# EAGLE board stream_i-o_2_3 (EAGLE 7.5.0), part 1 of 2
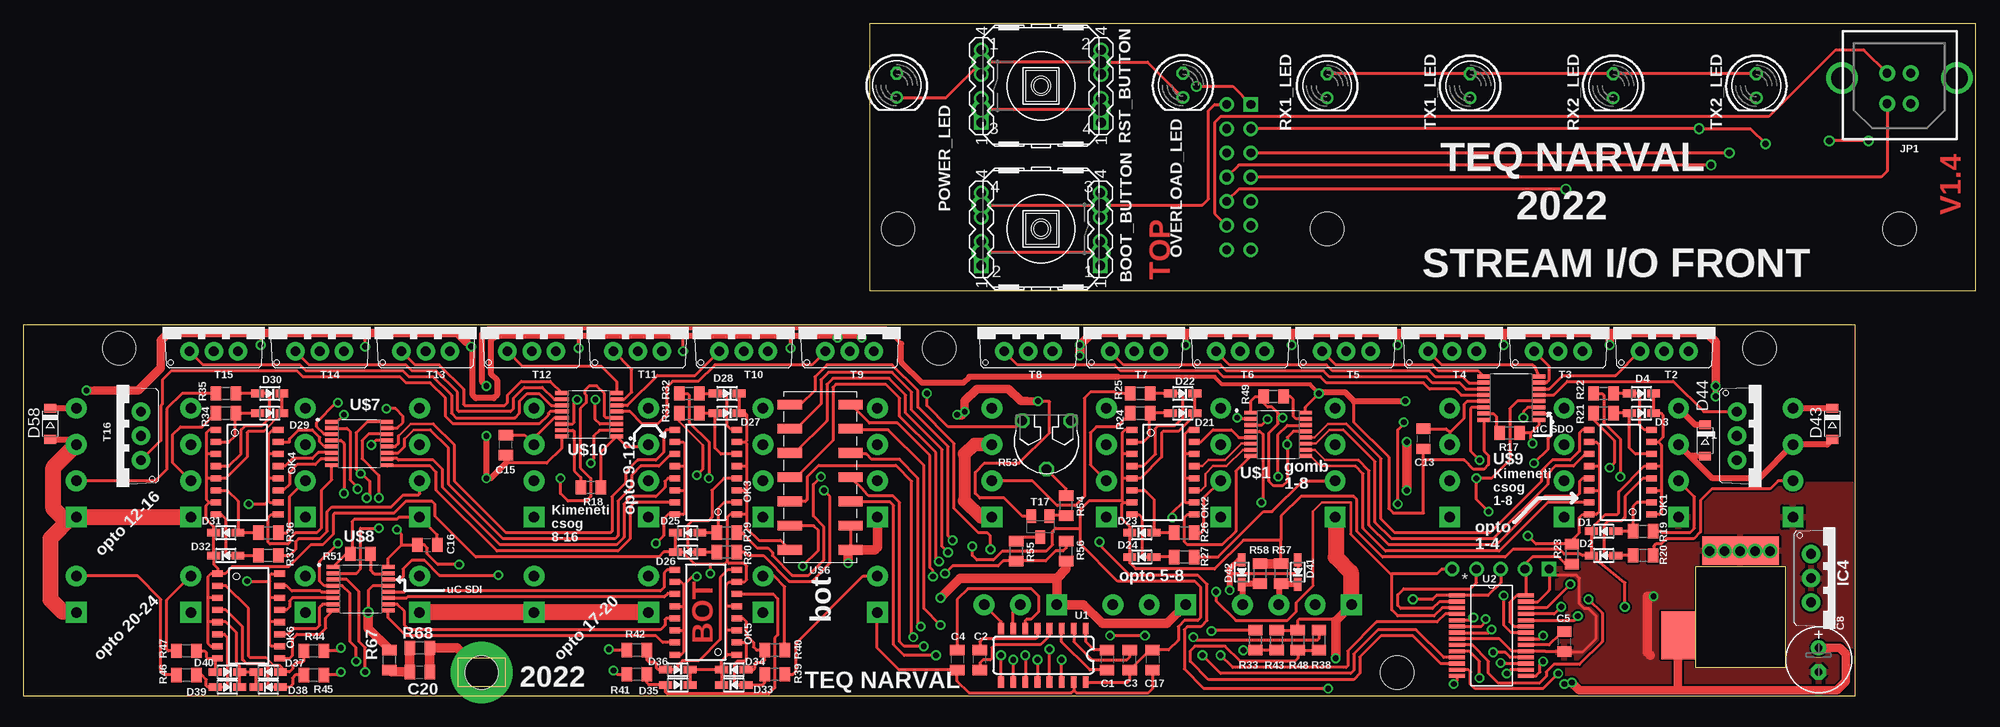
[diagram p3: board, top side]
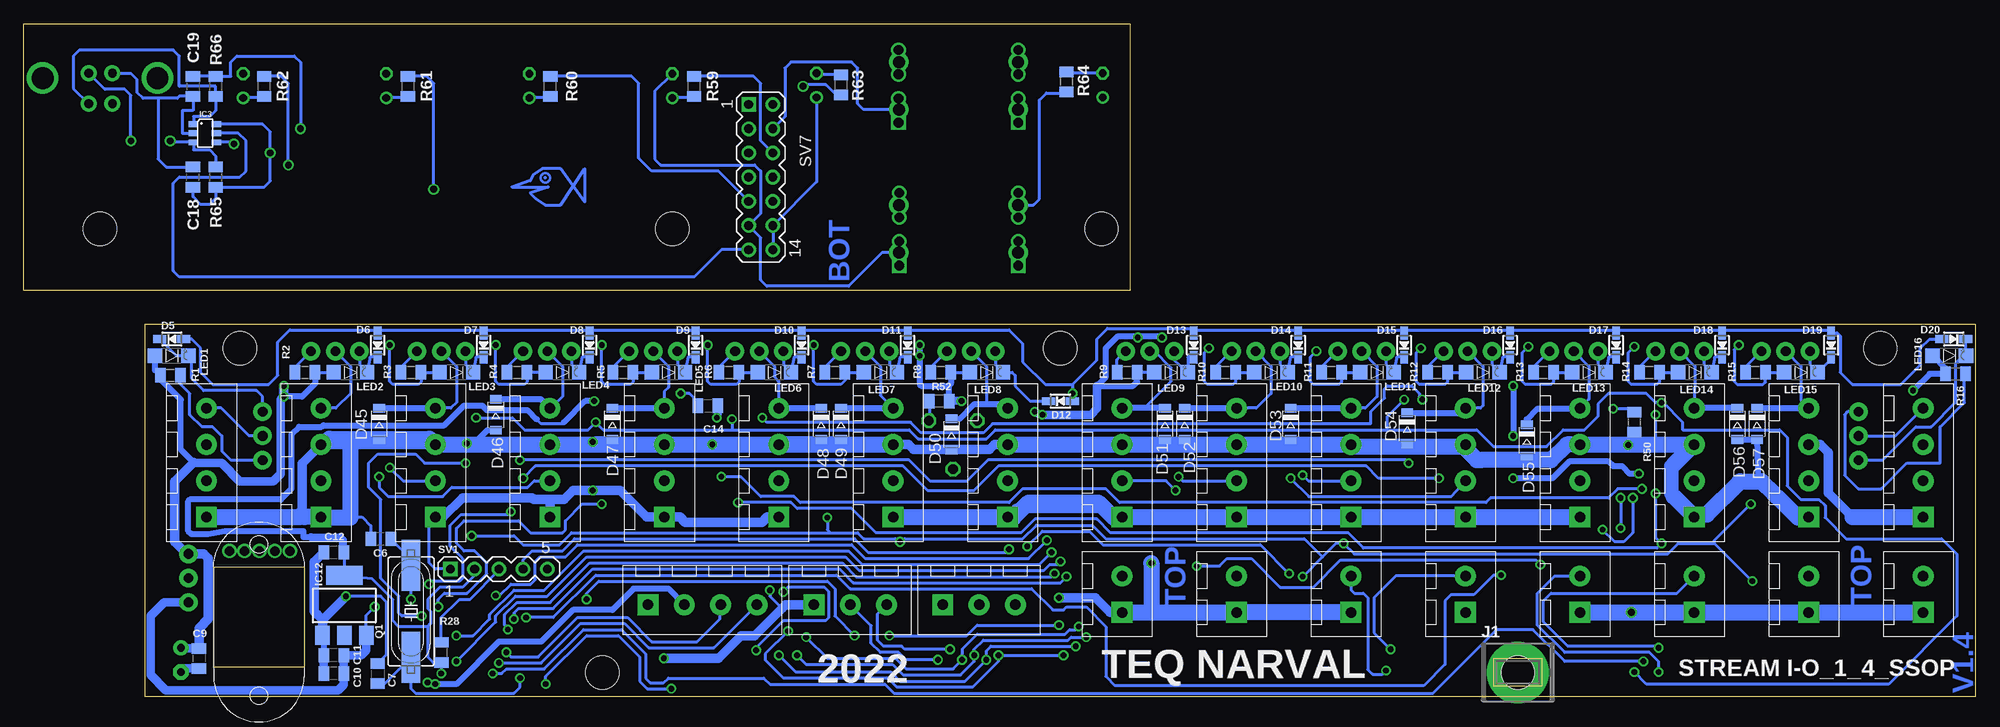
[diagram p4: board, bottom side, seen from below]

Size 204.65 x 70.53 mm. Coordinates in mm from the lower left corner, seen from the top.
Outline: 192,0 0,0 0,39 192,39 192,0
Outline: 88.65,42.53 204.65,42.53 204.65,70.53 88.65,70.53 88.65,42.53
Copper layers (1*16): Top 0.035mm / dielectric 1.5mm / Bottom 0.035mm
Design rules "10mil *": minimum track width 10mil, minimum drill 24mil, track to track 7mil, track to pad 7mil, pad to pad 7mil, via to via 7mil, smd to smd 7mil, copper to edge 5mil, drill to drill 5mil, minimum pad ring 10mil, minimum via ring 8mil, stop-mask expansion 4mil, vias tented up to drill 0mil, thermal gap 10mil
Net classes: 0 default: width 0.203 mm, clearance 0.203 mm
Holes 3.5 mm at 182,36.5 96,36.5 10,36.5 144,2.5 48,2.5 136.65,49.03 196.65,49.03 91.65,49.03

## Footprints (pad centres in the part's own frame; a part is rotated, then mirrored left to right if it is on the bottom)
RACON12 = drill 1.27 pad 2.032: 1 -6.248,2.489; 2 6.248,2.489; 3 -6.248,-2.489; 4 6.248,-2.489
C0805 = smd 1.1 x 1.5: 1 -1.05,0; 2 1.05,0
E2,5-7 = drill 0.813 pad 1.6: + -1.27,0 | drill 0.813 pad 1.6 octagon: - 1.27,0
SOD-323 = smd 1.35 x 0.8: A 1.27,0; C -1.27,0
SOD-123 = smd 0.91 x 1.22: A 1.635,0; C -1.635,0
DC_55/21 = smd 8 x 3 bottom: 1 0,6.985 | smd 3.5 x 5 bottom: 2 6.565,-1.905
TSOP-6 = smd 0.6 x 1: 1 -0.95,-1.2; 2 0,-1.2; 3 0.95,-1.2; 4 0.95,1.2; 5 0,1.2; 6 -0.95,1.2
TO220V = drill 1.016 pad 1.93: 1 -2.54,-2.54; 2 0,-2.54; 3 2.54,-2.54
SOT223 = smd 1.5 x 2: 1 -2.3,-3.15; 2 0,-3.15; 3 2.3,-3.15 | smd 3.8 x 2: 4 0,3.15
62221 = drill 3.5 pad 6.452: 1 0,0
USB-B-PTH-VERTICAL = drill 0.914 pad 1.676: D+ -1.206,-1.321; D- -1.206,1.88; GND 1.283,-1.321; VBUS 1.283,1.88 | drill 2.286: P$1 -6.032,-0.813; P$2 6.007,-0.813
CHIPLED_1206 = smd 1.5 x 1.5: A 0,-1.75; C 0,1.75
MINI-FLAT-16 = smd 1.118 x 0.635: 1 -3.265,4.445; 2 -3.265,3.175; 3 -3.265,1.905; 4 -3.265,0.635; 5 -3.265,-0.635; 6 -3.265,-1.905; 7 -3.265,-3.175; 8 -3.265,-4.445; 9 3.265,-4.445; 10 3.265,-3.175; 11 3.265,-1.905; 12 3.265,-0.635; 13 3.265,0.635; 14 3.265,1.905; 15 3.265,3.175; 16 3.265,4.445
LED5MM = drill 0.813 octagon: A -1.27,0 | drill 0.813: K 1.27,0
HC49UP = smd 5.334 x 1.93: 1 -4.826,0; 2 4.826,0
R0805 = smd 1.1 x 1.5: 1 -1.05,0; 2 1.05,0
PT-6 = drill 1.016 octagon: A -2.54,-5.08; E 2.54,-5.08; S 0,0
MA05-1 = drill 0.914 pad 1.524 square: 1 -5.08,0 | drill 0.914 pad 1.524: 2 -2.54,0; 3 0,0; 4 2.54,0; 5 5.08,0
MA04-1 = drill 1.016 square: 1 -3.81,0 | drill 1.016: 2 -1.27,0; 3 1.27,0; 4 3.81,0
MA07-2 = drill 0.914 pad 1.524 square: 1 -7.62,-1.27 | drill 0.914 pad 1.524: 2 -7.62,1.27; 3 -5.08,-1.27; 4 -5.08,1.27; 5 -2.54,-1.27; 6 -2.54,1.27; 7 0,-1.27; 8 0,1.27; 9 2.54,-1.27; 10 2.54,1.27; 11 5.08,-1.27; 12 5.08,1.27; 13 7.62,-1.27; 14 7.62,1.27
SOT23-BEC = smd 1 x 1.4: B -0.95,-1.1; C 0,1.1; E 0.95,-1.1
SO016 = smd 0.6 x 1.2: 1 -4.445,-2.8; 2 -3.175,-2.8; 3 -1.905,-2.8; 4 -0.635,-2.8; 5 0.635,-2.8; 6 1.905,-2.8; 7 3.175,-2.8; 8 4.445,-2.8; 9 4.445,2.8; 10 3.175,2.8; 11 1.905,2.8; 12 0.635,2.8; 13 -0.635,2.8; 14 -1.905,2.8; 15 -3.175,2.8; 16 -4.445,2.8
SSOP28_MC = smd 1.676 x 0.432: 1 -3.617,4.225; 2 -3.617,3.575; 3 -3.617,2.925; 4 -3.617,2.275; 5 -3.617,1.625; 6 -3.617,0.975; 7 -3.617,0.325; 8 -3.617,-0.325; 9 -3.617,-0.975; 10 -3.617,-1.625; 11 -3.617,-2.275; 12 -3.617,-2.925; 13 -3.617,-3.575; 14 -3.617,-4.225; 15 3.617,-4.225; 16 3.617,-3.575; 17 3.617,-2.925; 18 3.617,-2.275; 19 3.617,-1.625; 20 3.617,-0.975; 21 3.617,-0.325; 22 3.617,0.325; 23 3.617,0.975; 24 3.617,1.625; 25 3.617,2.275; 26 3.617,2.925; 27 3.617,3.575; 28 3.617,4.225
SSOP = smd 1.47 x 0.41: 1 -2.87,2.275; 2 -2.87,1.625; 3 -2.87,0.975; 4 -2.87,0.325; 5 -2.87,-0.325; 6 -2.87,-0.975; 7 -2.87,-1.625; 8 -2.87,-2.275; 9 2.87,-2.275; 10 2.87,-1.625; 11 2.87,-0.975; 12 2.87,-0.325; 13 2.87,0.325; 14 2.87,0.975; 15 2.87,1.625; 16 2.87,2.275
PIN_HEADER_2X7 = smd 1.016 x 2.54: 1A -7.62,3.175; 1B -7.62,-3.175; 2A -5.08,3.175; 2B -5.08,-3.175; 3A -2.54,3.175; 3B -2.54,-3.175; 4A 0,3.175; 4B 0,-3.175; 5A 2.54,3.175; 5B 2.54,-3.175; 6A 5.08,3.175; 6B 5.08,-3.175; 7A 7.62,3.175; 7B 7.62,-3.175
ZOLD_KICSI_2P = drill 1.1 pad 2.184 square: 1 -1.905,-0.5 | drill 1.1 pad 2.184: 2 1.905,-0.5
ZOLD_KICSI_3P = drill 1.1 pad 2.184 square: 1 -3.81,-0.5 | drill 1.1 pad 2.184: 2 0,-0.5; 3 3.81,-0.5
ZOLD_KICSI_4P = drill 1.1 pad 2.184 square: 1 -5.715,-0.5 | drill 1.1 pad 2.184: 2 -1.905,-0.5; 3 1.905,-0.5; 4 5.715,-0.5

## Placement (x,y rotation side)
BOOT_BUTTON  BUTTONRACON12  [RACON12]  106.65,49.03 180 top
C1  1u  [C0805]  113.58,3.81 270 top
C2  1u  [C0805]  100.24,3.81 90 top
C3  1u  [C0805]  115.96,3.81 90 top
C4  1u  [C0805]  97.86,3.81 270 top
C5  10u  [C0805]  161.52,5.71 270 top
C6  22p  [C0805]  167.24,16.51 0 bottom
C7  22p  [C0805]  167.55,2.38 270 bottom
C8  220u  [E2,5-7]  188.19,3.81 270 top
C9  100n  [C0805]  186.28,3.97 270 bottom
C10  10u  [C0805]  172.16,2.38 180 bottom
C11  10u  [C0805]  172.16,4.29 180 bottom
C12  10u  [C0805]  172.16,15.08 180 bottom
C13  100n  [C0805]  146.76,26.99 90 top
C14  100n  [C0805]  132.94,30.48 0 bottom
C15  100n  [C0805]  50.55,26.35 90 top
C16  100n  [C0805]  42.3,15.88 0 top
C17  100n  [C0805]  118.34,3.81 270 top
C18  47p  [C0805]  186.92,54.45 90 bottom
C19  47p  [C0805]  186.92,63.98 270 bottom
C20  100n  [C0805]  41.51,2.54 0 top
D1  1N4148  [SOD-323]  165.65,17.3 0 top
D2  1N4148  [SOD-323]  165.65,14.76 0 top
D3  1N4148  [SOD-323]  169.62,29.69 180 top
D4  1N4148  [SOD-323]  169.62,31.75 180 top
D5  1N4148  [SOD-323]  189.14,37.47 0 bottom
D6  1N4148  [SOD-323]  167.55,36.83 90 bottom
D7  1N4148  [SOD-323]  156.44,36.83 90 bottom
D8  1N4148  [SOD-323]  145.33,36.83 90 bottom
D9  1N4148  [SOD-323]  134.22,36.83 90 bottom
D10  1N4148  [SOD-323]  123.1,36.83 90 bottom
D11  1N4148  [SOD-323]  111.99,36.83 90 bottom
D12  1N4148  [SOD-323]  95.96,30.96 0 bottom
D13  1N4148  [SOD-323]  81.99,36.83 90 bottom
D14  1N4148  [SOD-323]  71.03,36.83 90 bottom
D15  1N4148  [SOD-323]  59.92,36.83 90 bottom
D16  1N4148  [SOD-323]  48.81,36.83 90 bottom
D17  1N4148  [SOD-323]  37.7,36.83 90 bottom
D18  1N4148  [SOD-323]  26.58,36.83 90 bottom
D19  1N4148  [SOD-323]  15.15,36.83 90 bottom
D20  1N4148  [SOD-323]  2.29,37.47 180 bottom
D21  1N4148  [SOD-323]  121.52,29.69 180 top
D22  1N4148  [SOD-323]  121.52,31.75 180 top
D23  1N4148  [SOD-323]  117.23,17.14 0 top
D24  1N4148  [SOD-323]  117.23,14.61 0 top
D25  1N4148  [SOD-323]  69.6,17.14 0 top
D26  1N4148  [SOD-323]  69.6,15.12 0 top
D27  1N4148  [SOD-323]  73.73,29.69 180 top
D28  1N4148  [SOD-323]  73.73,31.75 180 top
D29  1N4148  [SOD-323]  25.79,29.69 180 top
D30  1N4148  [SOD-323]  25.79,31.75 180 top
D31  1N4148  [SOD-323]  21.19,17.14 0 top
D32  1N4148  [SOD-323]  21.19,14.76 0 top
D33  1N4148  [SOD-323]  74.45,1.19 0 top
D34  1N4148  [SOD-323]  74.45,2.78 0 top
D35  1N4148  [SOD-323]  68.57,1.19 180 top
D36  1N4148  [SOD-323]  68.57,2.78 180 top
D37  1N4148  [SOD-323]  25.63,2.54 0 top
D38  1N4148  [SOD-323]  25.63,0.95 0 top
D39  1N4148  [SOD-323]  21.34,0.95 180 top
D40  1N4148  [SOD-323]  21.34,2.54 180 top
D41  1N4148  [SOD-323]  133.58,13.02 90 top
D42  1N4148  [SOD-323]  127.71,13.02 90 top
D43  [SOD-123]  189.62,28.58 270 top
D44  [SOD-123]  176.28,26.83 270 top
D45  [SOD-123]  167.39,28.58 270 bottom
D46  [SOD-123]  155.17,29.53 270 bottom
D47  [SOD-123]  142.95,28.58 270 bottom
D48  [SOD-123]  121.04,28.58 270 bottom
D49  [SOD-123]  118.97,28.58 270 bottom
D50  [SOD-123]  107.39,27.46 270 bottom
D51  [SOD-123]  85,28.58 270 bottom
D52  [SOD-123]  82.94,28.58 270 bottom
D53  [SOD-123]  71.83,28.58 270 bottom
D54  [SOD-123]  59.6,28.1 270 bottom
D55  [SOD-123]  47.06,26.83 270 bottom
D56  [SOD-123]  25,28.58 270 bottom
D57  [SOD-123]  22.93,28.58 270 bottom
D58  [SOD-123]  2.77,28.58 270 top
DC1  DC_55/21  [DC_55/21]  180,8.3 0 bottom
IC3  BEM_VEDO  [TSOP-6]  185.65,59.05 270 bottom
IC4  7805TV  [TO220V]  189.94,12.38 270 top
IC12  LD117AS33TR  [SOT223]  171.05,9.53 0 bottom
J1  PIN1-2  [62221]  48,2.5 0 bottom
JP1  USBPTH-VERTICAL  [USB-B-PTH-VERTICAL]  196.65,64.03 180 top
LED1  RED  [CHIPLED_1206]  189.14,35.72 270 bottom
LED2  RED  [CHIPLED_1206]  170.41,33.97 270 bottom
LED3  RED  [CHIPLED_1206]  159.3,33.97 270 bottom
LED4  RED  [CHIPLED_1206]  148.19,33.97 270 bottom
LED5  RED  [CHIPLED_1206]  137.07,33.97 270 bottom
LED6  RED  [CHIPLED_1206]  125.96,33.97 270 bottom
LED7  RED  [CHIPLED_1206]  114.85,33.97 270 bottom
LED8  RED  [CHIPLED_1206]  103.73,33.97 270 bottom
LED9  RED  [CHIPLED_1206]  84.37,33.97 270 bottom
LED10  RED  [CHIPLED_1206]  73.89,33.97 270 bottom
LED11  RED  [CHIPLED_1206]  62.78,33.97 270 bottom
LED12  RED  [CHIPLED_1206]  51.66,33.97 270 bottom
LED13  RED  [CHIPLED_1206]  40.55,33.97 270 bottom
LED14  RED  [CHIPLED_1206]  29.44,33.97 270 bottom
LED15  RED  [CHIPLED_1206]  18.33,33.97 270 bottom
LED16  RED  [CHIPLED_1206]  2.77,35.72 270 bottom
OK1  TLP281-4  [MINI-FLAT-16]  167.39,23.5 180 top
OK2  TLP281-4  [MINI-FLAT-16]  119.45,23.5 0 top
OK3  TLP281-4  [MINI-FLAT-16]  71.51,23.5 180 top
OK4  TLP281-4  [MINI-FLAT-16]  23.41,23.5 0 top
OK5  TLP281-4  [MINI-FLAT-16]  71.51,8.81 180 top
OK6  TLP281-4  [MINI-FLAT-16]  23.57,8.41 0 top
OVERLOAD_LED  RED  [LED5MM]  121.53,64.08 270 top
POWER_LED  KEK  [LED5MM]  91.53,64.08 270 top
Q1  20MHz  [HC49UP]  164.06,8.89 90 bottom
R1  6R8  [R0805]  189.3,33.66 180 bottom
R2  6R8  [R0805]  175.17,33.97 0 bottom
R3  6R8  [R0805]  164.06,33.97 0 bottom
R4  6R8  [R0805]  152.95,33.97 0 bottom
R5  6R8  [R0805]  141.84,33.97 0 bottom
R6  6R8  [R0805]  130.72,33.97 0 bottom
R7  6R8  [R0805]  119.61,33.97 0 bottom
R8  6R8  [R0805]  108.5,33.97 0 bottom
R9  6R8  [R0805]  88.97,33.97 0 bottom
R10  6R8  [R0805]  78.65,33.97 0 bottom
R11  6R8  [R0805]  67.54,33.97 0 bottom
R12  6R8  [R0805]  56.43,33.97 0 bottom
R13  6R8  [R0805]  45.32,33.97 0 bottom
R14  6R8  [R0805]  34.2,33.97 0 bottom
R15  6R8  [R0805]  23.09,33.97 0 bottom
R16  6R8  [R0805]  2.14,33.81 180 bottom
R17  10k  [R0805]  155.81,27.62 0 top
R18  10k  [R0805]  59.44,21.91 180 top
R19  2k2  [R0805]  169.78,17.3 180 top
R20  2k2  [R0805]  169.78,14.76 180 top
R21  2k2  [R0805]  165.65,29.69 0 top
R22  2k2  [R0805]  165.65,31.75 0 top
R23  2k2  [R0805]  162.31,14.92 270 top
R24  2k2  [R0805]  117.07,29.69 0 top
R25  2k2  [R0805]  117.07,31.75 0 top
R26  2k2  [R0805]  121.67,17.14 180 top
R27  2k2  [R0805]  121.67,14.61 180 top
R28  1k  [R0805]  160.88,4.6 270 bottom
R29  2k2  [R0805]  73.73,17.14 180 top
R30  2k2  [R0805]  73.73,15.12 180 top
R31  2k2  [R0805]  69.76,29.69 0 top
R32  2k2  [R0805]  69.76,31.75 0 top
R33  1k  [R0805]  129.13,5.87 90 top
R34  2k2  [R0805]  21.19,29.69 0 top
R35  2k2  [R0805]  21.19,31.75 0 top
R36  2k2  [R0805]  25.63,17.14 180 top
R37  2k2  [R0805]  25.63,14.76 180 top
R38  1k  [R0805]  135.8,5.87 90 top
R39  2k2  [R0805]  78.73,2.3 180 top
R40  2k2  [R0805]  78.73,4.84 180 top
R41  2k2  [R0805]  64.29,2.3 0 top
R42  2k2  [R0805]  64.29,4.84 0 top
R43  2k2  [R0805]  131.36,5.87 270 top
R44  2k2  [R0805]  30.39,4.76 180 top
R45  2k2  [R0805]  30.39,2.22 180 top
R46  2k2  [R0805]  17.06,2.22 0 top
R47  2k2  [R0805]  17.06,4.76 0 top
R48  2k2  [R0805]  133.58,5.87 270 top
R49  2k2  [R0805]  131.04,31.43 180 top
R50  2k2  [R0805]  35.79,28.73 270 bottom
R51  2k2  [R0805]  35.31,14.92 180 top
R52  4k7  [R0805]  108.66,30.96 0 bottom
R53  10k  [PT-6]  107.23,23.81 180 top
R54  10k  [R0805]  109.29,20 90 top
R55  10k  [R0805]  104.05,15.24 90 top
R56  3k3  [R0805]  109.29,15.24 90 top
R57  4k7  [R0805]  131.83,12.86 90 top
R58  4k7  [R0805]  129.61,12.86 90 top
R59  470  [R0805]  134.37,63.98 90 bottom
R60  2k2  [R0805]  149.46,63.98 90 bottom
R61  470  [R0805]  164.38,63.98 90 bottom
R62  2k2  [R0805]  179.46,63.98 90 bottom
R63  1k  [R0805]  118.97,64.14 270 bottom
R64  1k  [R0805]  95.32,64.45 270 bottom
R65  33  [R0805]  184.54,54.45 270 bottom
R66  33  [R0805]  184.54,63.98 90 bottom
R67  100  [R0805]  38.33,3.81 90 top
R68  10k  [R0805]  41.51,5.08 180 top
RST_BUTTON  BUTTONRACON12  [RACON12]  106.65,64.03 0 top
RX1_LED  ORANGE  [LED5MM]  136.65,64.03 270 top
RX2_LED  ORANGE  [LED5MM]  166.65,64.03 270 top
SV1  PROG  [MA05-1]  154.85,13.34 0 bottom
SV3  [MA04-1]  100.4,63.98 90 top
SV4  [MA04-1]  112.94,63.98 90 top
SV5  [MA04-1]  100.4,48.97 90 top
SV6  [MA04-1]  112.86,48.97 90 top
SV7  [MA07-2]  127.39,54.45 270 bottom
T1  BD242  [TO220V]  182.16,27.3 270 top
T2  BD242  [TO220V]  172,38.73 0 top
T3  BD242  [TO220V]  160.88,38.73 0 top
T4  BD242  [TO220V]  149.77,38.73 0 top
T5  BD242  [TO220V]  138.66,38.73 0 top
T6  BD242  [TO220V]  127.55,38.73 0 top
T7  BD242  [TO220V]  116.44,38.73 0 top
T8  BD242  [TO220V]  105.32,38.73 0 top
T9  BD242  [TO220V]  86.59,38.73 0 top
T10  BD242  [TO220V]  75.48,38.73 0 top
T11  BD242  [TO220V]  64.37,38.73 0 top
T12  BD242  [TO220V]  53.25,38.73 0 top
T13  BD242  [TO220V]  42.14,38.73 0 top
T14  BD242  [TO220V]  31.03,38.73 0 top
T15  BD242  [TO220V]  19.92,38.73 0 top
T16  BD242  [TO220V]  9.75,27.3 90 top
T17  BC858  [SOT23-BEC]  106.59,17.78 180 top
TX1_LED  GREEN  [LED5MM]  151.65,64.03 270 top
TX2_LED  GREEN  [LED5MM]  181.65,64.03 270 top
U1  MAX232SOIC16  [SO016]  106.91,4.29 180 top
U2  PIC32MX250F128B-I_SS  [SSOP28_MC]  153.9,6.35 0 top
U$1  SCT2167SSOP  [SSOP]  131.52,27.46 0 top
U$6  PIN_HEADER_2X7  [PIN_HEADER_2X7]  83.49,22.97 270 top
U$7  SCT2167SSOP  [SSOP]  35.16,26.51 0 top
U$8  SCT2167SSOP  [SSOP]  35.31,11.27 0 top
U$9  SCT2167SSOP  [SSOP]  155.96,31.27 180 top
U$10  SCT2167SSOP  [SSOP]  59.29,29.53 180 top
ZOLD_2P1  ZOLD_KICSI_2P  [ZOLD_KICSI_2P]  90,10.7 90 bottom
ZOLD_2P2  ZOLD_KICSI_2P  [ZOLD_KICSI_2P]  78,10.7 90 bottom
ZOLD_2P3  ZOLD_KICSI_2P  [ZOLD_KICSI_2P]  66,10.7 90 bottom
ZOLD_2P4  ZOLD_KICSI_2P  [ZOLD_KICSI_2P]  54,10.7 90 bottom
ZOLD_2P5  ZOLD_KICSI_2P  [ZOLD_KICSI_2P]  42,10.7 90 bottom
ZOLD_2P6  ZOLD_KICSI_2P  [ZOLD_KICSI_2P]  30,10.7 90 bottom
ZOLD_2P7  ZOLD_KICSI_2P  [ZOLD_KICSI_2P]  18,10.7 90 bottom
ZOLD_2P8  ZOLD_KICSI_2P  [ZOLD_KICSI_2P]  6,10.7 90 bottom
ZOLD_3P1  ZOLD_KICSI_3P  [ZOLD_KICSI_3P]  118,10.1 0 bottom
ZOLD_3P2  ZOLD_KICSI_3P  [ZOLD_KICSI_3P]  104.5,10.1 0 bottom
ZOLD_4P1  ZOLD_KICSI_4P  [ZOLD_KICSI_4P]  186,24.5 90 bottom
ZOLD_4P2  ZOLD_KICSI_4P  [ZOLD_KICSI_4P]  174,24.5 90 bottom
ZOLD_4P3  ZOLD_KICSI_4P  [ZOLD_KICSI_4P]  162,24.5 90 bottom
ZOLD_4P4  ZOLD_KICSI_4P  [ZOLD_KICSI_4P]  150,24.5 90 bottom
ZOLD_4P5  ZOLD_KICSI_4P  [ZOLD_KICSI_4P]  138,24.5 90 bottom
ZOLD_4P6  ZOLD_KICSI_4P  [ZOLD_KICSI_4P]  126,24.5 90 bottom
ZOLD_4P7  ZOLD_KICSI_4P  [ZOLD_KICSI_4P]  114,24.5 90 bottom
ZOLD_4P8  ZOLD_KICSI_4P  [ZOLD_KICSI_4P]  102,24.5 90 bottom
ZOLD_4P9  ZOLD_KICSI_4P  [ZOLD_KICSI_4P]  90,24.5 90 bottom
ZOLD_4P10  ZOLD_KICSI_4P  [ZOLD_KICSI_4P]  78,24.5 90 bottom
ZOLD_4P11  ZOLD_KICSI_4P  [ZOLD_KICSI_4P]  66,24.5 90 bottom
ZOLD_4P12  ZOLD_KICSI_4P  [ZOLD_KICSI_4P]  54,24.5 90 bottom
ZOLD_4P13  ZOLD_KICSI_4P  [ZOLD_KICSI_4P]  42,24.5 90 bottom
ZOLD_4P14  ZOLD_KICSI_4P  [ZOLD_KICSI_4P]  30,24.5 90 bottom
ZOLD_4P15  ZOLD_KICSI_4P  [ZOLD_KICSI_4P]  18,24.5 90 bottom
ZOLD_4P16  ZOLD_KICSI_4P  [ZOLD_KICSI_4P]  6,24.5 90 bottom
ZOLD_4P17  ZOLD_KICSI_4P  [ZOLD_KICSI_4P]  133.5,10.1 0 bottom